# EAGLE design relay_shield (EAGLE 7.7.0)
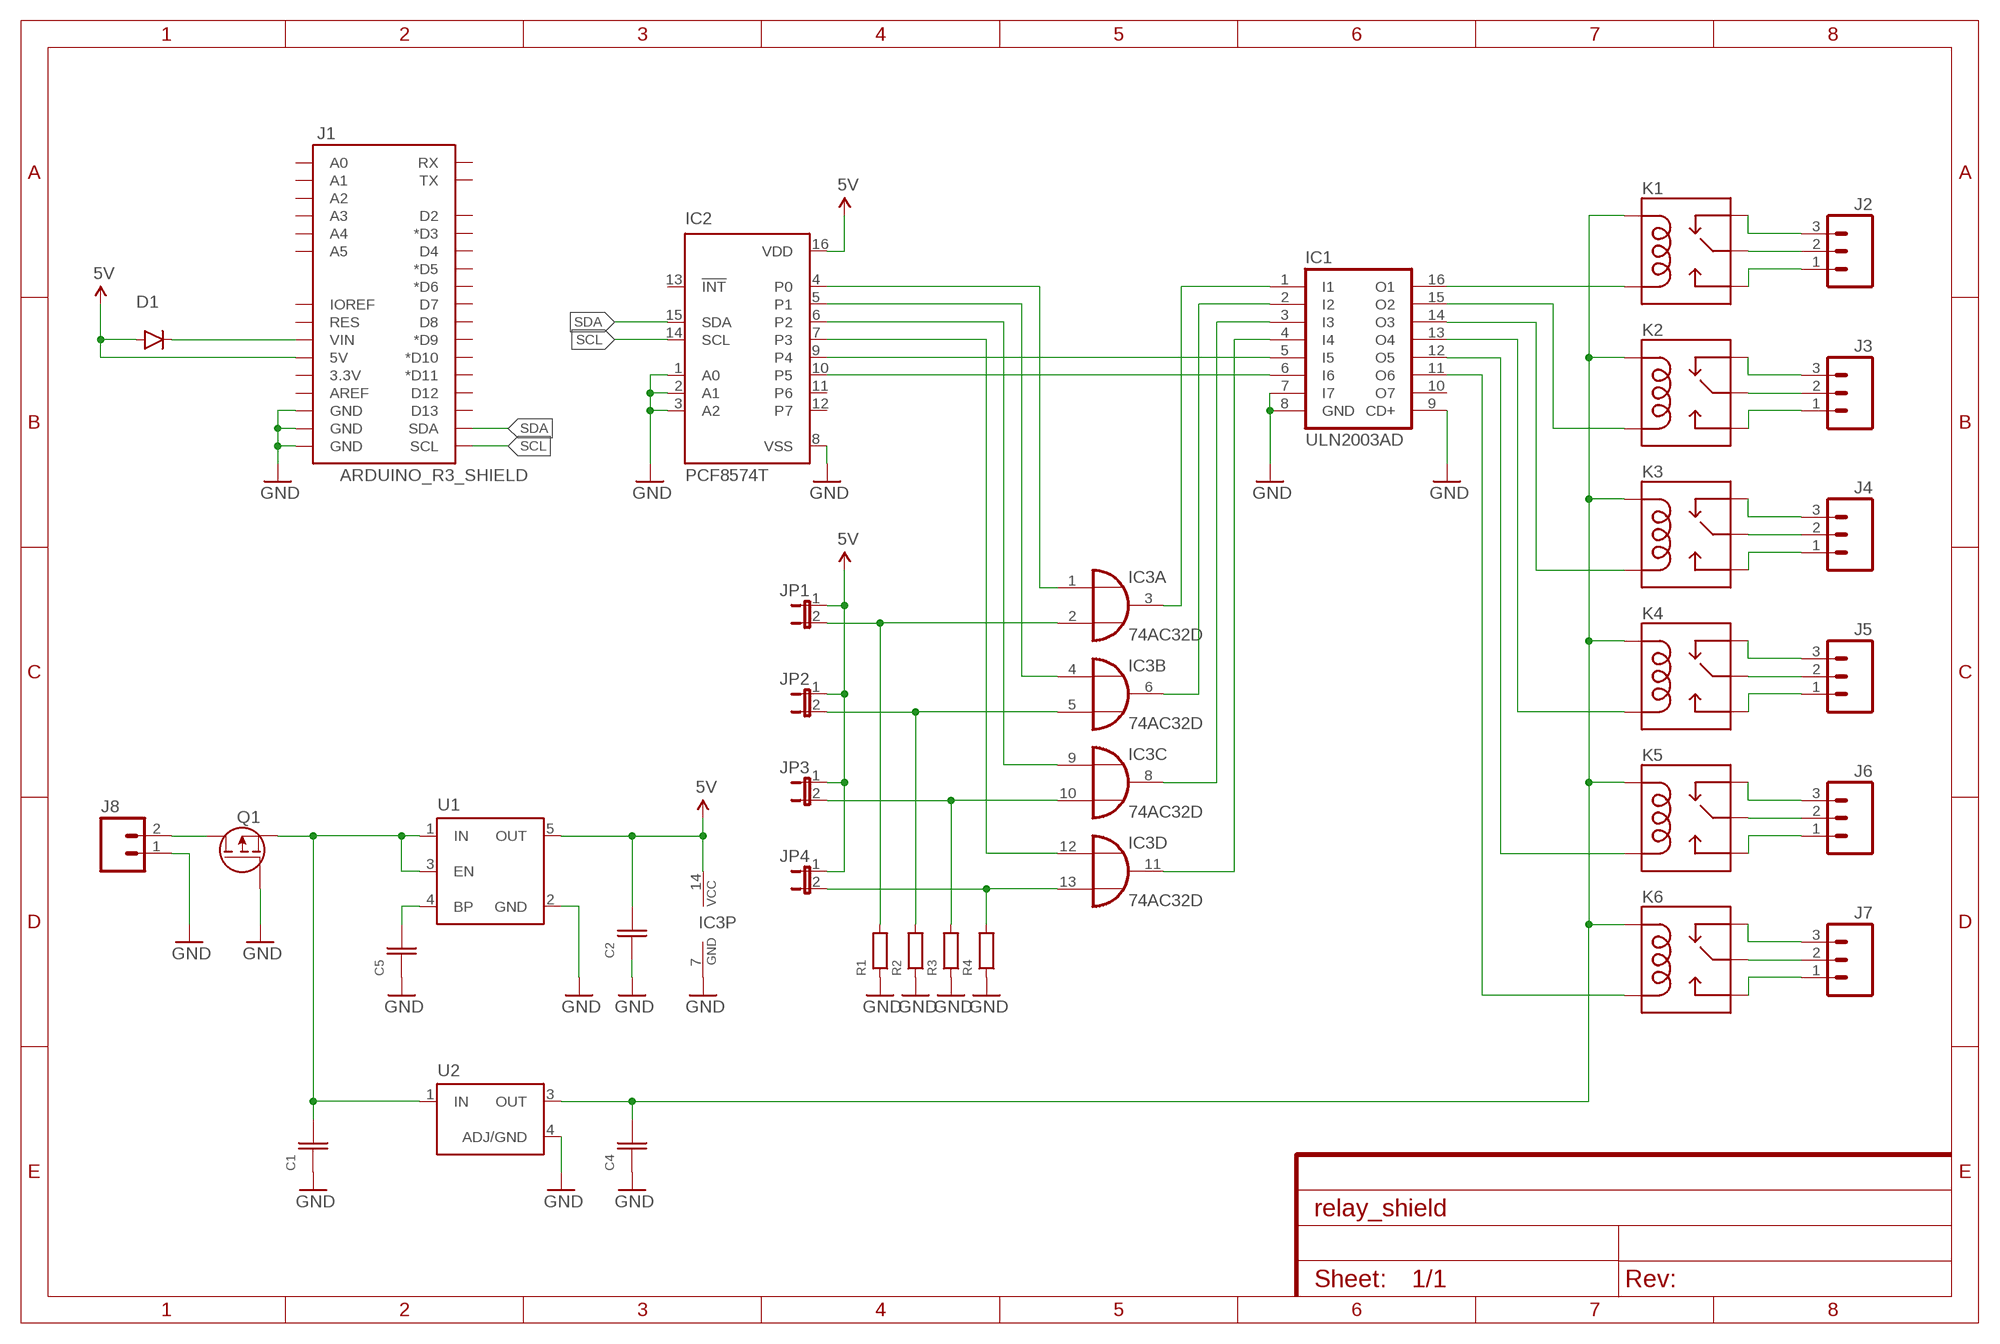
[diagram p0: schematic, sheet 1]

## Parts
C1  CAPACITOR_NPOL-1206  [C1206]
C2  CAPACITOR_NPOL-1206  [C1206]
C4  CAPACITOR_NPOL-1206  [C1206]
C5  CAPACITOR_NPOL-0603  [C603]
D1  DIODE-SOD323  [SOD-323]
IC1  ULN2003AD  [SO16]
IC2  PCF8574T  [SO16W]
IC3  74AC32D  [SO14]
J1  ARDUINO_R3_SHIELD  [UNO_R3_SHIELD]
J2  M03SCREW  [SCREWTERMINAL-3.5MM-3]
J3  M03SCREW  [SCREWTERMINAL-3.5MM-3]
J4  M03SCREW  [SCREWTERMINAL-3.5MM-3]
J5  M03SCREW  [SCREWTERMINAL-3.5MM-3]
J6  M03SCREW  [SCREWTERMINAL-3.5MM-3]
J7  M03SCREW  [SCREWTERMINAL-3.5MM-3]
J8  M023.5MM  [SCREWTERMINAL-3.5MM-2]
JP1  JP1E  [JP1]
JP2  JP1E  [JP1]
JP3  JP1E  [JP1]
JP4  JP1E  [JP1]
K1  RELAY-SPDTPTH6  [RELAY-SCHRACK-RY211]
K2  RELAY-SPDTPTH6  [RELAY-SCHRACK-RY211]
K3  RELAY-SPDTPTH6  [RELAY-SCHRACK-RY211]
K4  RELAY-SPDTPTH6  [RELAY-SCHRACK-RY211]
K5  RELAY-SPDTPTH6  [RELAY-SCHRACK-RY211]
K6  RELAY-SPDTPTH6  [RELAY-SCHRACK-RY211]
Q1  MOSFET-P-SOT23-3  [SOT23-3]
R1  RESISTOR-0603  [R0603]
R2  RESISTOR-0603  [R0603]
R3  RESISTOR-0603  [R0603]
R4  RESISTOR-0603  [R0603]
U1  VREG-5PIN-SOT23  [SOT23-5]
U2  VREG-3PIN-DPAK  [DPAK]

## Nets
5V: C2.2 D1.A IC2.16(VDD) IC3.14(P:VCC) J1.5V JP1.1 JP2.1 JP3.1 JP4.1 U1.5(OUT)
GND: C1.1 C2.1 C4.1 C5.1 IC1.7(I7) IC1.8(GND) IC1.9(CD+) IC2.1(A0) IC2.2(A1) IC2.3(A2) IC2.8(VSS) IC3.7(P:GND) J1.GND@0(GND) J1.GND@1(GND) J1.GND@2(GND) J8.1 Q1.1(G) R1.1 R2.1 R3.1 R4.1 U1.2(GND) U2.4(ADJ/GND)
N$1: IC3.2(A:I1) JP1.2 R1.2
N$2: IC3.5(B:I1) JP2.2 R2.2
N$3: J2.2 K1.11(MAIN)
N$4: C1.2 Q1.2(S) U1.1(IN) U1.3(EN) U2.1(IN)
N$5: C5.2 U1.4(BP)
N$6: C4.2 K1.A1(COIL1) K2.A1(COIL1) K3.A1(COIL1) K4.A1(COIL1) K5.A1(COIL1) K6.A1(COIL1) U2.3(OUT)
N$7: J3.2 K2.11(MAIN)
N$8: J4.2 K3.11(MAIN)
N$9: J5.2 K4.11(MAIN)
N$10: J6.2 K5.11(MAIN)
N$11: J7.2 K6.11(MAIN)
N$12: IC1.16(O1) K1.A2(COIL2)
N$13: IC1.15(O2) K2.A2(COIL2)
N$14: IC1.14(O3) K3.A2(COIL2)
N$15: IC1.13(O4) K4.A2(COIL2)
N$16: IC1.12(O5) K5.A2(COIL2)
N$17: IC1.11(O6) K6.A2(COIL2)
N$18: IC1.1(I1) IC3.3(A:O)
N$19: IC1.2(I2) IC3.6(B:O)
N$20: IC1.3(I3) IC3.8(C:O)
N$21: IC1.4(I4) IC3.11(D:O)
N$22: IC1.5(I5) IC2.9(P4)
N$23: IC1.6(I6) IC2.10(P5)
N$24: D1.C J1.VIN
N$25: IC3.10(C:I1) JP3.2 R3.2
N$26: IC3.13(D:I1) JP4.2 R4.2
N$27: IC2.4(P0) IC3.1(A:I0)
N$28: IC2.5(P1) IC3.4(B:I0)
N$29: IC2.6(P2) IC3.9(C:I0)
N$30: IC2.7(P3) IC3.12(D:I0)
N$31: J8.2 Q1.3(D)
N$32: J2.3 K1.12(NC)
N$33: J2.1 K1.14(NO)
N$34: J3.3 K2.12(NC)
N$35: J3.1 K2.14(NO)
N$36: J4.3 K3.12(NC)
N$37: J4.1 K3.14(NO)
N$38: J5.3 K4.12(NC)
N$39: J5.1 K4.14(NO)
N$40: J6.3 K5.12(NC)
N$41: J6.1 K5.14(NO)
N$42: J7.3 K6.12(NC)
N$43: J7.1 K6.14(NO)
SCL: IC2.14(SCL) J1.SCL
SDA: IC2.15(SDA) J1.SDA
Unconnected: IC1.10(O7) IC2.11(P6) IC2.12(P7) IC2.13(!INT) J1.3.3V J1.A0 J1.A1 J1.A2 J1.A3 J1.A4 J1.A5 J1.AREF J1.D2 J1.D3(*D3) J1.D4 J1.D5(*D5) J1.D6(*D6) J1.D7 J1.D8 J1.D9(*D9) J1.D10(*D10) J1.D11(*D11) J1.D12 J1.D13 J1.IOREF J1.RES J1.RX J1.TX

## Library data of the parts
C1 C2 C4 C5 = kg-generic:CAPACITOR_NPOL: Non-Polarized capacitor in various packages
D1 = kg-generic:DIODE: Diode These are standard reverse protection diodes and small signal diodes. SMA package can handle up to about 1A. SOD-323 can handle about 200mA. What the SOD-323 package when ordering, there are some mfgs out there that are 5-pin packages.
IC1 = uln-udn:ULN2003A: DRIVER ARRAY
IC2 = micro-philips:PCF8574: I2C-Bus Remote 8-bit I/O expander http://www.semiconductors.philips.com/acrobat_download/datasheets/PCF8574_4.pdf; MPN: PCF8574T/3,512; OC_FARNELL: 1201255; OC_NEWARK: 70R6870
IC3 = 74xx-eu:74*32: Quad 2-input OR gate
J1 = SparkFun-Boards:ARDUINO_R3_SHIELD: Shield form compatible with the Arduino Uno R3.
J2-J7 = SparkFun-Connectors:M03: Header 3 Standard 3-pin 0.1" header. Use with straight break away headers (SKU : PRT-00116), right angle break away headers (PRT-00553), swiss pins (PRT-00743), machine pins (PRT-00117), and female headers (PRT-00115). Molex polarized connector foot print use with SKU : PRT-08232 with associated crimp pins and housings.; PROD_ID: CONN-08288
J8 = SparkFun-Connectors:M02: Standard 2-pin 0.1" header. Use with - straight break away headers ( PRT-00116) - right angle break away headers (PRT-00553) - swiss pins (PRT-00743) - machine pins (PRT-00117) - female headers (PRT-00115) Molex polarized connector foot print use with: PRT-08233 with associated crimp pins and housings. 2.54_SCREWTERM for use with PRT-10571. 3.5mm Screw Terminal footprints for PRT-08084 5mm Screw Terminal footprints for use with PRT-08432; PROD_ID: CONN-08399
JP1-JP4 = jumper:JP1E: JUMPER
K1-K6 = kg-relays:RELAY-SPDT: SPDT relay (COM-00101)
Q1 = kg-generic:MOSFET-P: Generic P-MOSFET IRF7406 SO8 30V 5.8A 45mOhm IRLML6401 SOT23-3 12V 4.3A 50mOhm IRLML6402 SOT23-3 20V 3.7A 65mOhm
R1-R4 = kg-generic:RESISTOR: Generic resistor
U1 = kg-generic:VREG-5PIN: Linear voltage regulator with enable pin and a bypass capacitor pin: LP3985
U2 = kg-generic:VREG-3PIN: Generic 3-pin linear voltage regulator

## Board
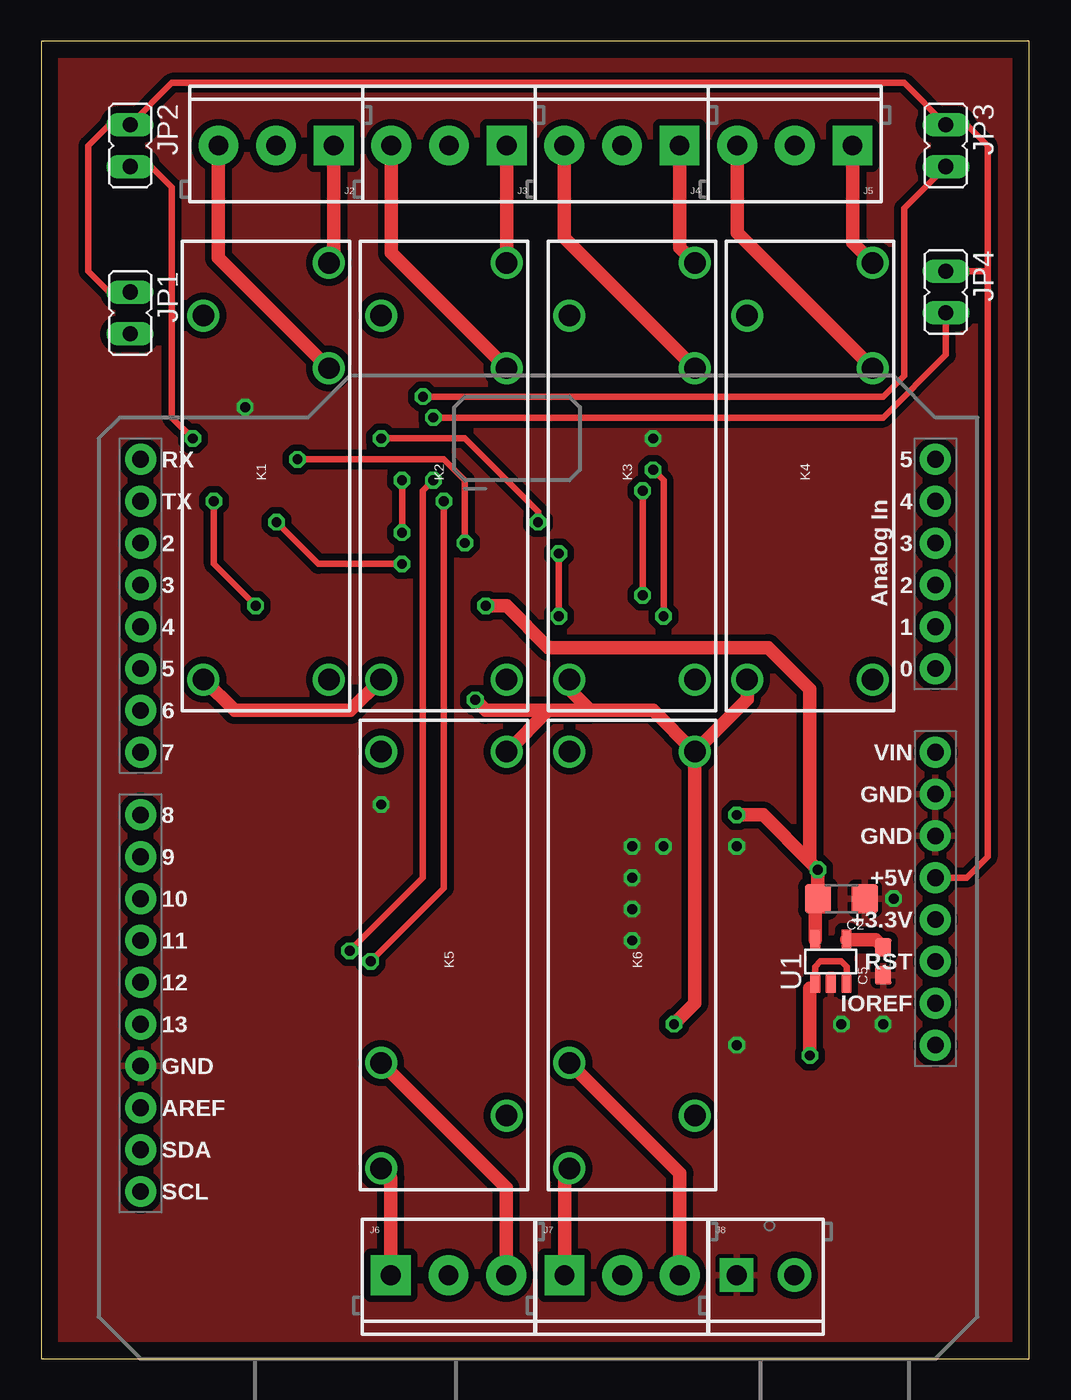
[diagram p1: board, top side]
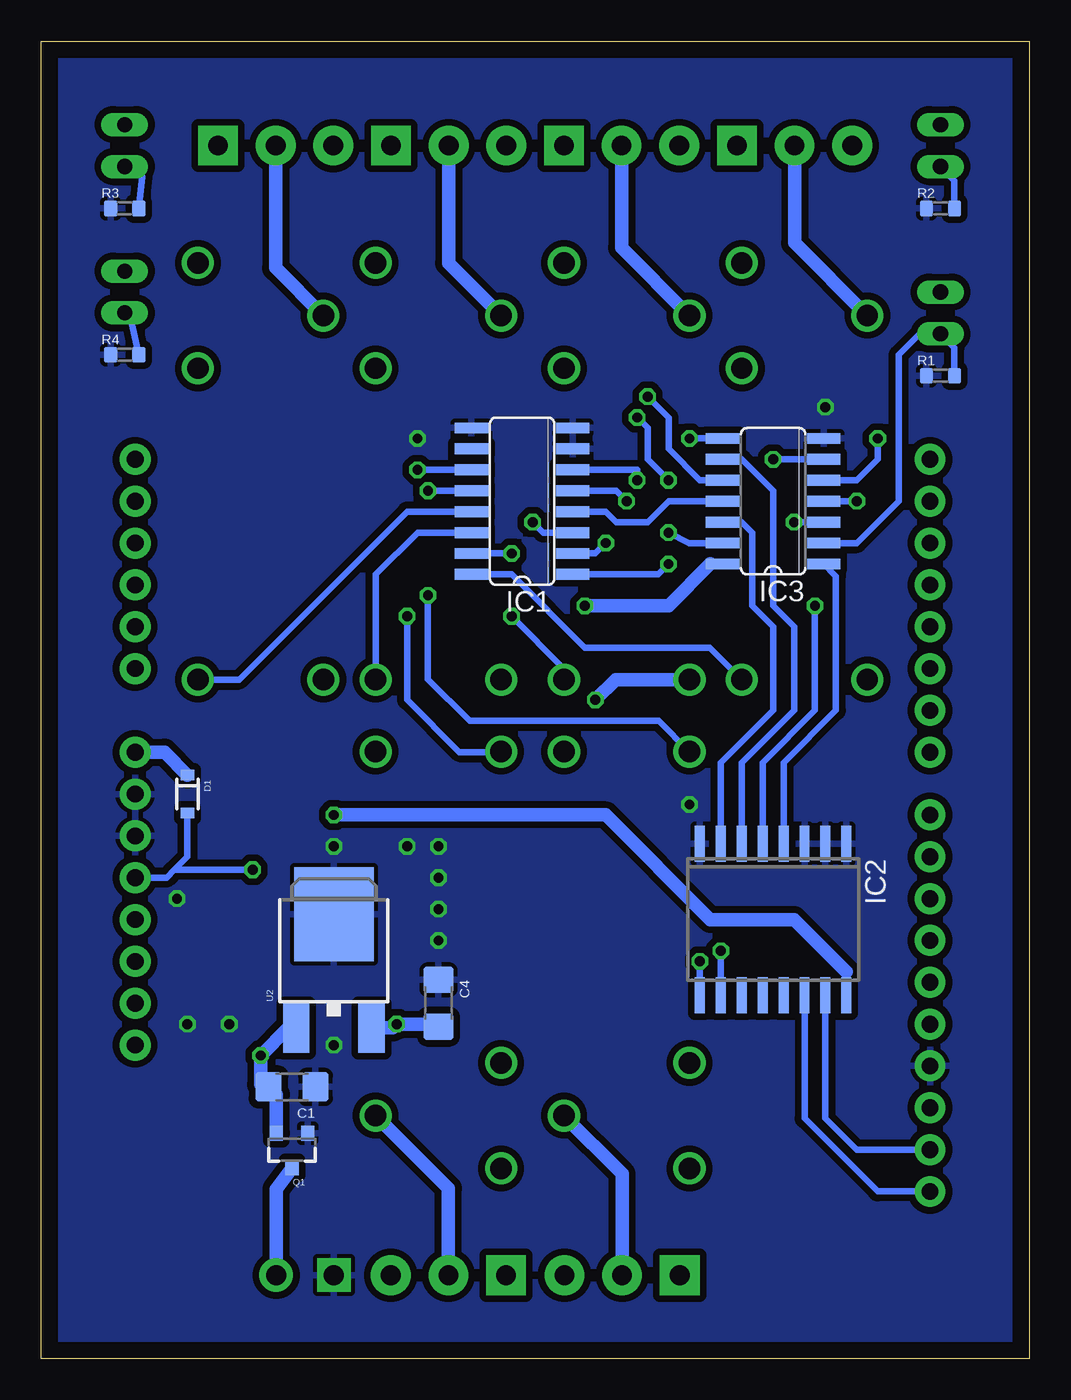
[diagram p2: board, bottom side, seen from below]

Size 60 x 80 mm. Coordinates in mm from the lower left corner, seen from the top.
Outline: 0,0 60,0 60,80 0,80 0,0
Copper layers (1*16): Top 0.035mm / dielectric 1.5mm / Bottom 0.035mm
Design rules "default": minimum track width 10mil, minimum drill 24mil, track to track 8mil, track to pad 8mil, pad to pad 8mil, via to via 8mil, smd to smd 8mil, copper to edge 40mil, drill to drill 8mil, minimum pad ring 10mil, minimum via ring 8mil, stop-mask expansion 4mil, vias tented up to drill 0mil, thermal gap 10mil

### Footprints (pad centres in the part's own frame; a part is rotated, then mirrored left to right if it is on the bottom)
C1206 = smd 1.6 x 1.803: 1 -1.422,0; 2 1.422,0
C603 = smd 1.1 x 1: 1 -0.85,0; 2 0.85,0
SOD-323 = smd 0.63 x 0.83: A 1.15,0; C -1.15,0
SO16 = smd 0.66 x 2.032: 1 -4.445,-3.073; 2 -3.175,-3.073; 3 -1.905,-3.073; 4 -0.635,-3.073; 5 0.635,-3.073; 6 1.905,-3.073; 7 3.175,-3.073; 8 4.445,-3.073; 9 4.445,3.073; 10 3.175,3.073; 11 1.905,3.073; 12 0.635,3.073; 13 -0.635,3.073; 14 -1.905,3.073; 15 -3.175,3.073; 16 -4.445,3.073
SO16W = smd 0.6 x 2.2: 1 -4.445,-4.6; 2 -3.175,-4.6; 3 -1.905,-4.6; 4 -0.635,-4.6; 5 0.635,-4.6; 6 1.905,-4.6; 7 3.175,-4.6; 8 4.445,-4.6; 9 4.445,4.6; 10 3.175,4.6; 11 1.905,4.6; 12 0.635,4.6; 13 -0.635,4.6; 14 -1.905,4.6; 15 -3.175,4.6; 16 -4.445,4.6
SO14 = smd 0.66 x 2.032: 1 -3.81,-3.073; 2 -2.54,-3.073; 3 -1.27,-3.073; 4 0,-3.073; 5 1.27,-3.073; 6 2.54,-3.073; 7 3.81,-3.073; 8 3.81,3.073; 9 2.54,3.073; 10 1.27,3.073; 11 0,3.073; 12 -1.27,3.073; 13 -2.54,3.073; 14 -3.81,3.073
UNO_R3_SHIELD = drill 1.016 pad 1.88: 3.3V 50.8,26.67; 5V 50.8,29.21; A0 50.8,41.91; A1 50.8,44.45; A2 50.8,46.99; A3 50.8,49.53; A4 50.8,52.07; A5 50.8,54.61; AREF 2.54,15.24; D2 2.54,49.53; D3 2.54,46.99; D4 2.54,44.45; D5 2.54,41.91; D6 2.54,39.37; D7 2.54,36.83; D8 2.54,33.02; D9 2.54,30.48; D10 2.54,27.94; D11 2.54,25.4; D12 2.54,22.86; D13 2.54,20.32; GND@0 50.8,31.75; GND@1 50.8,34.29; GND@2 2.54,17.78; IOREF 50.8,21.59; NC 50.8,19.05; RES 50.8,24.13; RX 2.54,54.61; SCL 2.54,10.16; SDA 2.54,12.7; TX 2.54,52.07; VIN 50.8,36.83
SCREWTERMINAL-3.5MM-3 = drill 1.2 pad 2.413 square: 1 0,0 | drill 1.2 pad 2.413: 2 3.5,0; 3 7,0
SCREWTERMINAL-3.5MM-2 = drill 1.2 pad 2.032 square: 1 0,0 | drill 1.2 pad 2.032: 2 3.5,0
JP1 = drill 0.914 long: 1 0,-1.27; 2 0,1.27
RELAY-SCHRACK-RY211 = drill 1.3: 11 10,3.81; 12 6.8,-3.81; 14 13.2,-3.81; A1 -12.1,3.81; A2 -12.1,-3.81
SOT23-3 = smd 0.8 x 0.9: 1 -0.95,-1; 2 0.95,-1; 3 0,1.1
R0603 = smd 0.8 x 0.95: 1 -0.85,0; 2 0.85,0
SOT23-5 = smd 0.6 x 1.2: 1 -0.95,-1.306; 2 0,-1.306; 3 0.95,-1.306; 4 0.95,1.306; 5 -0.95,1.306
DPAK = smd 1.6 x 3: 1 -2.28,-5.31; 3 2.28,-5.31 | smd 4.826 x 5.715: 4 0,1.588

### Placement (x,y rotation side)
C1  44.77,16.51 180 bottom
C2  48.58,27.94 180 top
C4  35.88,21.59 270 bottom
C5  51.12,24.13 90 top
D1  51.12,34.29 270 bottom
IC1  30.8,52.07 90 bottom
IC2  15.56,26.67 180 bottom
IC3  15.56,52.07 90 bottom
J1  3.5,0 0 top
J2  17.76,73.66 180 top
J3  28.26,73.66 180 top
J4  38.76,73.66 180 top
J5  49.26,73.66 180 top
J6  21.23,5.08 0 top
J7  31.77,5.08 0 top
J8  42.23,5.08 0 top
JP1  5.4,63.5 180 top
JP2  5.4,73.66 180 top
JP3  54.93,73.66 180 top
JP4  54.93,64.77 180 top
K1  13.66,53.34 90 top
K2  24.45,53.34 90 top
K3  35.88,53.34 90 top
K4  46.67,53.34 90 top
K5  24.45,24.77 270 top
K6  35.88,24.77 270 top
Q1  44.77,12.7 180 bottom
R1  5.4,59.69 0 bottom
R2  5.4,69.85 0 bottom
R3  54.93,69.85 0 bottom
R4  54.93,60.96 0 bottom
U1  47.94,24.13 0 top
U2  42.23,25.4 0 bottom

### Tracks (layer width: path | path; a pad name or v marks a point on that pad's centre or on a via)
5V  (via drill 0.6)
  Top 0.406: JP1.1 4.13,64.77 2.86,66.04 2.86,73.66 4.13,74.93 JP2.1 7.94,77.47 52.39,77.47 JP3.1 56.2,74.93 57.47,73.66 57.47,66.04 | 57.47,66.04 57.47,30.48 56.2,29.21 J1.5V | JP4.1 57.47,66.04
  Top 0.813: v26.99,45.72 28.26,45.72 30.8,43.18 44.14,43.18 46.67,40.64 46.67,30.18 | 46.67,30.18 v47.16,29.69 C2.2 47,27.47 U1.5 | 46.67,30.18 43.83,33.02 v42.23,33.02
  Bottom 0.406: IC3.14 19.37,48.26 | IC2.16 11.11,23.5 | D1.A 51.12,30.48 51.91,29.69 | J1.5V 52.39,29.21 51.91,29.69 | v47.16,29.69 51.91,29.69
  Bottom 0.813: 19.37,48.26 21.91,45.72 v26.99,45.72 | 11.11,23.5 14.29,26.67 19.37,26.67 25.72,33.02 v42.23,33.02
GND  (via drill 0.6)
  other vias: 48.58,20.32 51.12,20.32 51.75,27.94 42.23,19.05 35.88,25.4 42.23,31.11 35.88,31.11 35.88,29.21 37.78,31.11 35.88,27.3 20.64,33.66 12.38,57.78 37.15,55.88
  pour Bottom (isolate 0.406): -7.3,82.55 70.17,82.55 70.17,-2.54 -7.3,-2.54
  pour Top (isolate 0.406): -8.57,83.82 71.44,83.82 71.44,-3.81 -8.57,-3.81
N$1
  Bottom 0.406: IC3.2 10.48,49.53 7.94,52.07 7.94,60.96 6.67,62.23 JP1.2 4.55,61.38 R1.2
N$2  (via drill 0.6)
  Top 0.406: v9.21,55.88 7.94,57.15 7.94,71.12 6.67,72.39 JP2.2
  Bottom 0.406: IC3.5 10.48,53.34 9.21,54.61 v9.21,55.88 | R2.2 4.55,71.54 JP2.2
N$3
  Bottom 0.813: J2.2 14.26,67.75 K1.11
N$4  (via drill 0.6)
  Top 0.406: U1.3 48.89,23.82 48.58,24.13 47.31,24.13 47,23.82 U1.1 46.67,22.5
  Top 0.813: v46.67,18.41 46.67,22.5
  Bottom 0.406: 46.67,16.66 C1.2 | U2.1 45,20.09
  Bottom 0.813: 46.67,16.66 v46.67,18.41 45,20.09 | Q1.2 45.72,16.04 C1.2
N$5
  Top 0.813: U1.4 50.66,25.44 C5.2
N$6  (via drill 0.6)
  Top 0.406: K1.A1 9.88,41.24 | K5.A1 28.3,36.87 | K6.A1 39.66,36.87
  Top 0.813: 9.88,41.24 11.75,39.37 18.77,39.37 K2.A1 | 30.8,39.37 33.34,39.37 | 28.3,36.87 30.8,39.37 | K3.A1 32.07,40.64 33.34,39.37 | 39.66,36.87 37.15,39.37 33.34,39.37 | K4.A1 42.87,40.04 K6.A1 39.69,21.59 v38.42,20.32 | 30.8,39.37 26.99,39.37 v26.35,40.01
  Bottom 0.406: 38.65,20.09 v38.42,20.32 | 36.03,20.32 C4.2
  Bottom 0.813: K2.A1 25.12,41.24 v26.35,40.01 | U2.3 38.65,20.09 | v38.42,20.32 36.03,20.32
N$7
  Bottom 0.813: J3.2 24.76,67.46 K2.11
N$8
  Bottom 0.813: J4.2 35.26,66.53 K3.11
N$9
  Bottom 0.813: J5.2 45.76,66.23 K4.11
N$10
  Bottom 0.813: J6.2 24.73,11.23 K5.11
N$11
  Bottom 0.813: J7.2 35.27,10.35 K6.11
N$12
  Bottom 0.406: IC1.16 31.44,47.62 26.99,43.18 19.41,43.18 K1.A2
N$13  (via drill 0.6)
  Top 0.406: v31.44,45.09 v31.44,48.9
  Bottom 0.406: IC1.15 v31.44,48.9 | K2.A2 28.26,41.91 v31.44,45.09
N$14
  Bottom 0.406: IC1.14 37.15,50.16 39.69,47.62 K3.A2
N$15
  Bottom 0.406: IC1.13 37.78,51.44 47.98,41.24 K4.A2
N$16  (via drill 0.6)
  Top 0.406: v36.52,52.7 v36.52,46.35
  Bottom 0.406: IC1.12 v36.52,52.7 | K5.A2 22.51,38.73 33.98,38.73 36.52,41.27 v36.52,46.35
N$17  (via drill 0.6)
  Top 0.406: v37.78,45.09 37.78,53.34 v37.15,53.98
  Bottom 0.406: v37.15,53.98 IC1.11 | v37.78,45.09 37.78,40.01 34.61,36.83 32.1,36.83 K6.A2
N$18  (via drill 0.6)
  Top 0.406: v21.91,48.26 16.83,48.26 v14.29,50.8
  Bottom 0.406: IC1.1 22.55,47.62 v21.91,48.26 | v14.29,50.8 IC3.3
N$19  (via drill 0.6)
  Top 0.406: v15.56,54.61 24.45,54.61 25.72,53.34 v25.72,49.53
  Bottom 0.406: IC3.6 v15.56,54.61 | IC1.2 26.35,48.9 v25.72,49.53
N$20  (via drill 0.6)
  Top 0.406: v30.16,50.8 30.16,51.44 25.72,55.88 v20.64,55.88
  Bottom 0.406: IC1.3 29.53,50.16 v30.16,50.8 | v20.64,55.88 IC3.8
N$21
  Bottom 0.406: IC1.4 25.72,51.44 25.09,50.8 23.18,50.8 21.91,52.07 IC3.11
N$22  (via drill 0.6)
  Top 0.406: v24.45,52.07 24.45,28.57 v20.01,24.13
  Bottom 0.406: 26.99,52.7 IC1.5 25.09,52.7 v24.45,52.07 | IC2.9 v20.01,24.13
N$23  (via drill 0.6)
  Top 0.406: v23.81,53.34 23.18,52.7 23.18,29.21 v18.73,24.77
  Bottom 0.406: IC1.6 23.81,53.98 v23.81,53.34 | IC2.10 v18.73,24.77
N$24
  Bottom 0.813: J1.VIN 52.51,36.83 D1.C
N$25  (via drill 0.6)
  Top 0.406: v23.18,58.42 51.12,58.42 52.39,59.69 52.39,69.85 JP3.2
  Bottom 0.406: IC3.10 20.01,53.34 21.91,55.24 21.91,57.15 v23.18,58.42 | JP3.2 53.88,71.75 R3.2
N$26  (via drill 0.6)
  Top 0.406: v21.91,50.16 v21.91,53.34 | v23.81,57.15 51.12,57.15 54.93,60.96 JP4.2
  Bottom 0.406: IC3.13 20.64,49.53 v21.91,50.16 | v21.91,53.34 23.18,54.61 23.18,56.52 v23.81,57.15 | JP4.2 54.51,62.87 R4.2
N$27
  Bottom 0.406: IC2.4 14.92,36.2 11.75,39.37 11.75,47.52 IC3.1
N$28  (via drill 0.6)
  Top 0.406: v13.02,45.72 10.48,48.26 v10.48,52.07
  Bottom 0.406: IC2.5 16.2,36.2 13.02,39.37 v13.02,45.72 | v10.48,52.07 IC3.4
N$29
  Bottom 0.406: IC2.6 17.47,36.2 14.29,39.37 14.29,44.45 15.56,45.72 15.56,52.7 17.47,54.61 IC3.9
N$30
  Bottom 0.406: IC2.7 18.73,36.2 15.56,39.37 15.56,44.45 16.83,45.72 16.83,50.16 17.47,50.8 IC3.12
N$31
  Bottom 0.813: J8.2 45.73,10.3 Q1.3
N$32
  Top 0.813: J2.3 10.76,66.84 K1.12
N$33
  Top 0.813: J2.1 17.76,66.83 K1.14
N$34
  Top 0.813: J3.3 21.26,67.14 K2.12
N$35
  Top 0.813: J3.1 K2.14
N$36
  Top 0.813: J4.3 31.76,68.07 K3.12
N$37
  Top 0.813: J4.1 38.76,67.47 K3.14
N$38
  Top 0.813: J5.3 42.26,68.36 K4.12
N$39
  Top 0.813: J5.1 49.26,67.77 K4.14
N$40
  Top 0.813: J6.3 28.23,10.38 K5.12
N$41
  Top 0.813: J6.1 21.23,10.97 K5.14
N$42
  Top 0.813: J7.3 38.77,11.26 K6.12
N$43
  Top 0.813: J7.1 31.77,11.27 K6.14
SCL
  Bottom 0.406: J1.SCL 9.21,10.16 13.66,14.61 IC2.14
SDA
  Bottom 0.406: J1.SDA 10.48,12.7 12.38,14.61 IC2.15